# Altium schematic sheet MCU.SchDoc
size A4; SheetNumber: 1; SheetTotal: 2
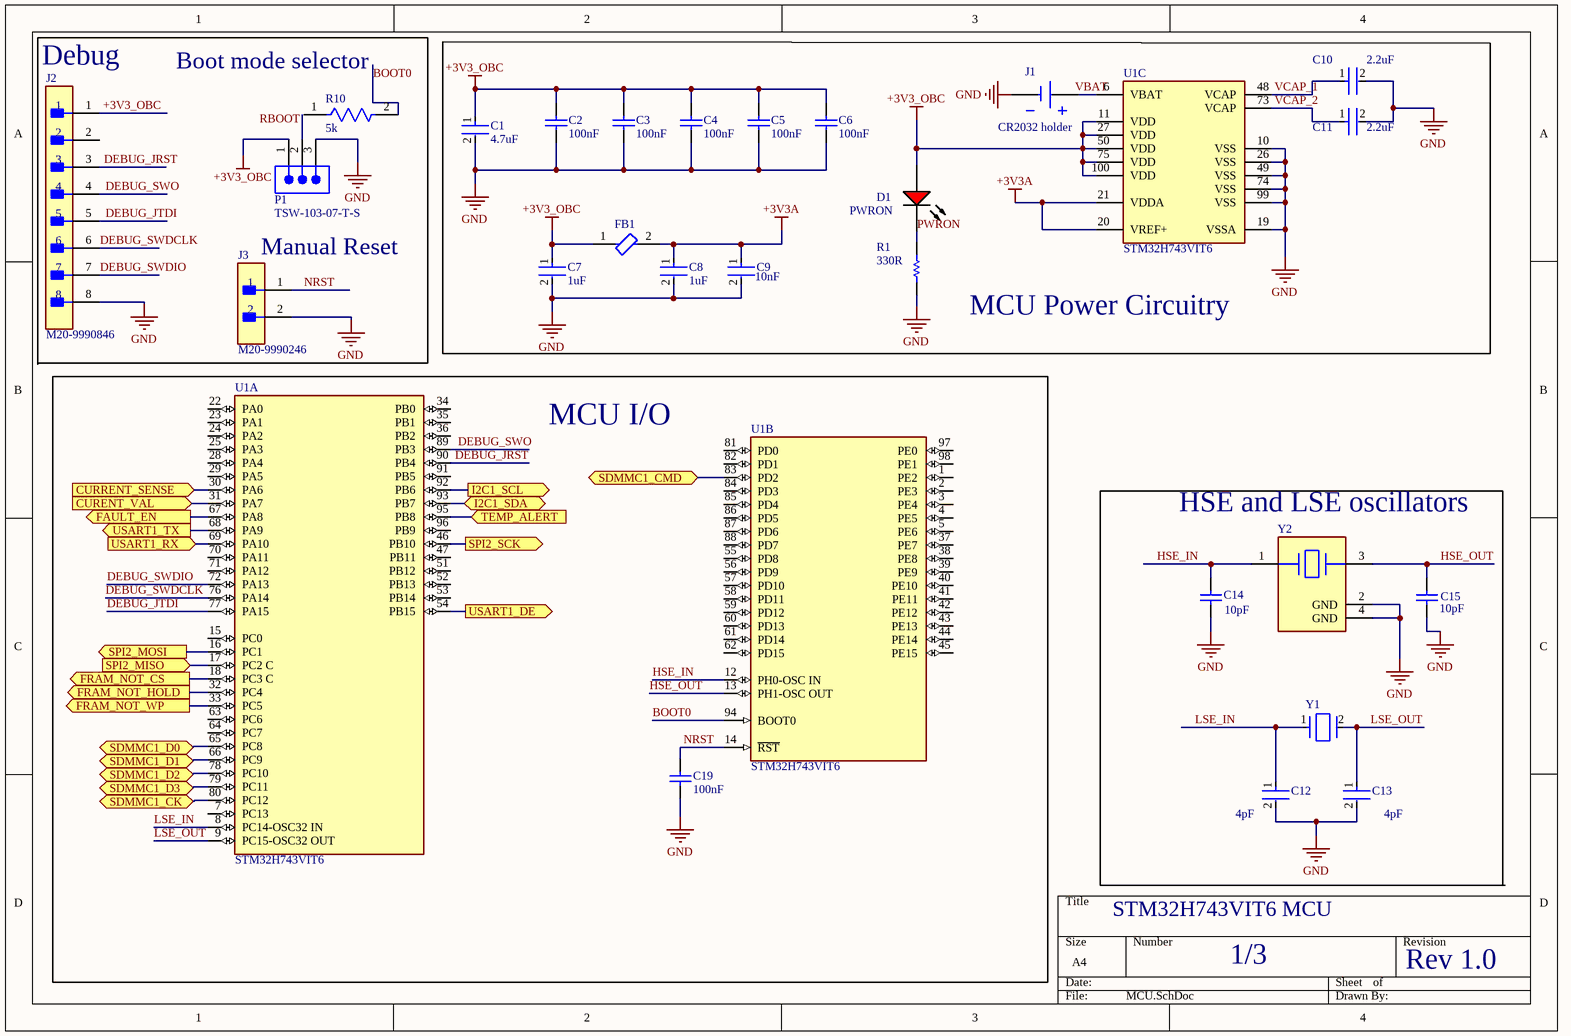
[diagram p0: MCU.SchDoc]

## Parts
C1  4.7uF  [FP-0805-L_2_0_0_1-W_1_25-IPC_B]
C2  100nF  [SAMS-C0603-2_M]
C3  100nF  [SAMS-C0603-2_M]
C4  100nF  [SAMS-C0603-2_M]
C5  100nF  [SAMS-C0603-2_M]
C6  100nF  [SAMS-C0603-2_M]
C7  1uF  [FP-CL10-IPC_C]
C8  1uF  [FP-CL10-IPC_C]
C9  10nF  [FP-CC0402-MFG]
C10  2.2uF  [FP-CC0805-0_85-MFG]
C11  2.2uF  [FP-CC0805-0_85-MFG]
C12  4pF  [FP-GRM033-0_03-IPC_B]
C13  4pF  [FP-GRM033-0_03-IPC_B]
C14  10pF  [CAPC1005X55X25ML05T05]
C15  10pF  [CAPC1005X55X25ML05T05]
C19  100nF  [SAMS-C0603-2_M]
D1  PWRON  [EVRL-0603-2_V]
FB1  MMZ1005D121CTD25  [FP-MMZ1005-IPC_C]  (value not drawn)
J1  CR2032 holder  [KEYSTONE-1025-7-2_V]
J2  M20-9990846  [FP-M20-9990846-MFG]
J3  M20-9990246  [FP-M20-9990246-MFG]
P1  TSW-103-07-T-S  [SMTC-TSW-103-07-X-S]
R1  330R  [RESC1608X55X25NL10T15]
R10  5k  [FP-MCR01-MFG]
U1  STM32H743VIT6  [FP-LQFP100-1L-MFG]  (parts A,B,C of 3)
Y1  ABS06-107-32.768KHZ-T  [FP-ABS06-MFG]  (value not drawn)
Y2  ABM3B-25.000MHZ-10-1-U-T  [FP-ABM3B-MFG]  (value not drawn)

## Blocks framed on the sheet
Debug: J2 J3 P1 R10
MCU Power Circuitry: C1-C11 D1 FB1 J1 R1 U1
MCU I/O: C19 U1
HSE and LSE oscillators: C12-C15 Y1 Y2

## Ports
CURENT_VAL (in), CURRENT_SENSE (in), FAULT_EN (out), FRAM_NOT_CS (out), FRAM_NOT_HOLD (out), FRAM_NOT_WP (out), I2C1_SCL (out), I2C1_SDA (bidir), SDMMC1_CK (bidir), SDMMC1_CMD (bidir), SDMMC1_D0 (bidir), SDMMC1_D1 (bidir), SDMMC1_D2 (bidir), SDMMC1_D3 (bidir), SPI2_MISO (in), SPI2_MOSI (out), SPI2_SCK (out), TEMP_ALERT (in), USART1_DE (out), USART1_RX (in), USART1_TX (out)

## Nets
+3V3_OBC: C1.1 C2.2 C3.2 C4.2 C5.2 C6.2 C7.1 D1.1(A) FB1.1 J2.1 P1.1 U1.11(VDD) U1.27(VDD) U1.50(VDD) U1.75(VDD) U1.100(VDD)
+3V3A: C8.1 C9.1 FB1.2 U1.20(VREF+) U1.21(VDDA)
GND: C1.2 C2.1 C3.1 C4.1 C5.1 C6.1 C7.2 C8.2 C9.2 C10.2 C11.2 C12.2 C13.2 C14.1 C15.1 C19.1 J1.2(-) J2.8 J3.2 P1.3 R1.1 U1.10(VSS) U1.19(VSSA) U1.26(VSS) U1.49(VSS) U1.74(VSS) U1.99(VSS) Y2.2(GND) Y2.4(GND)
BOOT0: R10.2 U1.94(BOOT0)
CURENT_VAL: U1.31(PA7) ; port CURENT_VAL
CURRENT_SENSE: U1.30(PA6) ; port CURRENT_SENSE
DEBUG_JRST: J2.3 U1.90(PB4)
DEBUG_JTDI: J2.5 U1.77(PA15)
DEBUG_SWDCLK: J2.6 U1.76(PA14)
DEBUG_SWDIO: J2.7 U1.72(PA13)
DEBUG_SWO: J2.4 U1.89(PB3)
FAULT_EN: U1.67(PA8) ; port FAULT_EN
FRAM_NOT_CS: U1.18(PC3_C) ; port FRAM_NOT_CS
FRAM_NOT_HOLD: U1.32(PC4) ; port FRAM_NOT_HOLD
FRAM_NOT_WP: U1.33(PC5) ; port FRAM_NOT_WP
HSE_IN: C14.2 U1.12(PH0-OSC_IN) Y2.1
HSE_OUT: C15.2 U1.13(PH1-OSC_OUT) Y2.3
I2C1_SCL: U1.92(PB6) ; port I2C1_SCL
I2C1_SDA: U1.93(PB7) ; port I2C1_SDA
LSE_IN: C12.1 U1.8(PC14-OSC32_IN) Y1.1
LSE_OUT: C13.1 U1.9(PC15-OSC32_OUT) Y1.2
NRST: C19.2 J3.1 U1.14(~{RST})
PWRON: D1.2(K) R1.2
SDMMC1_CK: U1.80(PC12) ; port SDMMC1_CK
SDMMC1_CMD: U1.83(PD2) ; port SDMMC1_CMD
SDMMC1_D0: U1.65(PC8) ; port SDMMC1_D0
SDMMC1_D1: U1.66(PC9) ; port SDMMC1_D1
SDMMC1_D2: U1.78(PC10) ; port SDMMC1_D2
SDMMC1_D3: U1.79(PC11) ; port SDMMC1_D3
SPI2_MISO: U1.17(PC2_C) ; port SPI2_MISO
SPI2_MOSI: U1.16(PC1) ; port SPI2_MOSI
SPI2_SCK: U1.46(PB10) ; port SPI2_SCK
TEMP_ALERT: U1.95(PB8) ; port TEMP_ALERT
USART1_DE: U1.54(PB15) ; port USART1_DE
USART1_RX: U1.69(PA10) ; port USART1_RX
USART1_TX: U1.68(PA9) ; port USART1_TX
VCAP_1: C10.1 U1.48(VCAP)
VCAP_2: C11.1 U1.73(VCAP)
NetJ1_1: J1.1(+) U1.6(VBAT)

Not connected (* = marked no-connect by the designer): J2 2; P1 2; R10 1; U1 1(PE2) 2(PE3) 3(PE4) 4(PE5) 5(PE6) 7(PC13) 15(PC0) 22(PA0) 23(PA1) 24(PA2) 25(PA3) 28(PA4) 29(PA5) 34(PB0) 35(PB1) 36(PB2) 37(PE7) 38(PE8) 39(PE9) 40(PE10) 41(PE11) 42(PE12) 43(PE13) 44(PE14) 45(PE15) 47(PB11) 51(PB12) 52(PB13) 53(PB14) 55(PD8) 56(PD9) 57(PD10) 58(PD11) 59(PD12) 60(PD13) 61(PD14) 62(PD15) 63(PC6) 64(PC7) 70(PA11) 71(PA12) 81(PD0) 82(PD1) 84(PD3) 85(PD4) 86(PD5) 87(PD6) 88(PD7) 91(PB5) 96(PB9) 97(PE0) 98(PE1)

## Notes on the sheet
- (near R10) Boot mode selector
- (near J3) Manual Reset
- STM32H743VIT6 MCU
- 1/3
- Rev 1.0
- Labels drawn without touching a wire or pin: RBOOT, VBAT

## Library data of the parts
C1 = CMP-14477-004784-2: Multilayer Ceramic Capacitor 4.7 uF 16V X7R 10% SMD 0805 T/R; Tolerance: 10%; Voltage Rating: 16V; Height: 1.25mm; Width: 0.049inch; Length: 2mm; Series: M; Case Code (Metric): 2012; Case Code (Imperial): 0805; Dielectric: X7R; Packaging: Tape and Reel; Case/Package: 0805; Capacitance: 4.7uF; Halogen Free: Halogen Free; RoHS Compliant: Yes; Package Quantity: 3000; Contact Plating: Tin; Max Operating Temperature: 125°C; Min Operating Temperature: -55°C; Resistor Type: Ceramic; Mount: Surface Mount; Voltage Rating (DC): 16V; Termination: SMD/SMT; Number of Pins: 2; Thickness: 0.053inch; Construction: Flat
C2-C6 C19 = CMP-2000-05332-1: Multi-layer Ceramic Capacitor, -55 to 125 degC, 2-Pin SMD (0603), RoHS, Tape and Reel; Manufacturer: Samsung Electro-Mechanics; Capacitance: 0.1µF; Rated Voltage: 50V; Dielectric: X7R; Tolerance (%): ±10%; Case Size/Dimension: 0603; Datasheet URL: https://datasheet.ciiva.com/29198/456651-da-01-en-vs-kondensator-0605-29198839.pdf; Manufacturer URL: http://www.samsungsem.com/global/index.jsp; Datasheet Version: Nov-10
C7 C8 = CMP-13271-004127-1: Cap Ceramic 1uF 25V X5R ±10% Pad SMD 0603 +85°C T/R; Height: 0.8mm; Capacitance: 1uF; Depth: 0.8mm; Package Quantity: 1; Mount: Surface Mount; Contact Plating: Tin; Voltage Rating: 25V; Dielectric: X5R; Packaging: Tape and Reel; Material: Ceramic; Case Code (Metric): 1608; Length: 1.6mm; Voltage: 25V; Min Operating Temperature: -55°C; Width: 0.031inch; Tolerance: 10%; Case/Package: 0603; Radiation Hardening: No; Case Code (Imperial): 0603; Thickness: 0.035inch; Lead Free: Lead Free; Max Operating Temperature: 85°C; Voltage Rating (DC): 25V
C9 = CMP-03422-000804-1: CAP CER 10000PF 10V X7R 0402; Manufacturer: YAGEO; Manufacturer Part Number: CC0402KRX7R6BB103; Automotive Grade: NA; Material: Ceramic; Tolerance: 0.1; Temperature Coefficient: 30ppm/°C; Temperature Characteristic: X7R; Digikey Description: CAP CER 10000PF 10V X7R 0402; Footprint Url: http://www.yageo.com/exep/pages/download/literatures/UPY-C_GEN_24.pdf; Category: Cap; RoHS: TRUE; Temperature Range Low: -55°C; Lead Free: Yes; ComponentLink2Description: Datasheet; Device Class L2: Capacitors; Temperature Range High: +125°C; Value: 10 nF; Ipc Land Pattern Name: CAPC10050X50; Temperature: -55°C to +125°C; ComponentLink2URL: http://www.yageo.com/documents/recent/UPY-GP_NP0_16V-to-50V_16.pdf; Device Class L3: Ceramic Capacitors; Capacitance: 10 nF; Package: CC0402; Height: 0.55mm; Automotive: No; Octopart: https://octopart.com/cc0402krx7r6bb103-yageo-26721868; Mouser Description: Multilayer Ceramic Capacitors MLCC - SMD/SMT 10nF 10V X7R 10%; Device Class L1: Passive Components; Voltage Rating: 10 V
C10 C11 = CMP-1036-04838-2: CAP CER 2.2UF 25V X7R 0805; Manufacturer Part Number: CC0805KKX7R8BB225; Manufacturer: Yageo; Material: Ceramic; Tolerance: 0.1; Device Class L1: Passive Components; Value: 2.2 uF; Temperature: -30°C to +85°C; Octopart: https://octopart.com/cc0805kkx7r8bb225-yageo-42522865; ComponentLink2Description: Datasheet; Capacitance: 2.2 uF; ComponentLink2URL: http://www.yageo.com/documents/recent/UPY-GPHC_Y5V_6.3V-to-50V_8.pdf; Mouser Description: Multilayer Ceramic Capacitors MLCC - SMD/SMT 2.2uF 25V X7R 10%; RoHS: TRUE; Temperature Range High: +85°C; Lead Free: Yes; Voltage Rating: 25 V; Height: 0.95mm; Category: Cap; Automotive: No; Digikey Description: CAP CER 2.2UF 25V X7R 0805; Temperature Characteristic: X7R; Ipc Land Pattern Name: CAPC200125X85; Device Class L2: Capacitors; Footprint Url: http://www.yageo.com/exep/pages/download/literatures/UPY-C_GEN_24.pdf; Package: CC0805-0.85; Device Class L3: Ceramic Capacitors; Temperature Range Low: -30°C
C12 C13 = CMP-2010-01389-2: Chip Multilayer Ceramic Capacitors for General Purpose, 0201, 4.0pF, C0G, 30ppm/°C, 0.25pF, 25V; Case Code (Imperial): 0201; Thickness: 0.013inch; Voltage Rating (DC): 25V; Termination: SMD/SMT; Dielectric: C0G; Length: 0.024inch; Height: 0.3mm; Width: 0.012inch; Min Operating Temperature: -55°C; Capacitance: 4pF; Case/Package: 0201; Voltage Rating: 25V; Case Code (Metric): 0603; Packaging: Tape and Reel; Max Operating Temperature: 125°C; Mount: Surface Mount; Package Quantity: 15000; Lead Free: Lead Free
C14 C15 = CMP-2100-03589-1: Chip Capacitor, 10 pF, +/- 5%, 50 V, -55 to 125 degC, 0402 (1005 Metric), RoHS, Tape and Reel; Manufacturer: Yageo; Insulation Resistance: 100GR; Voltage Rating (DC): 50V; Dielectric Material: Ceramic; Temperature Coefficient: 30ppm/degC; Dielectric: C0G; Termination: SMD/SMT; Package Reference: 0402; Lead Free: LeadFree; Composition: Ceramic; Tolerance: 5%; Case Code (Metric): 1005; Voltage Rating: 50V; Packaging: TapeandReel; Manufacturer URL: http://www.yageo.com/; REACH SVHC: NoSVHC; Max Operating Temperature: 125degC; Length: 1mm; Mount: SurfaceMount; Depth: 0.5mm; Min Operating Temperature: -55degC; Number of Pins: 2; Width: 0.02inch; Datasheet Version: Rev. 14, 07/2016; Package Quantity: 1; Datasheet URL: http://www.yageo.com/documents/recent/UPY-GP_NP0_16V-to-50V_14.pdf; Case Code (Imperial): 0402; RoHSCompliant: True; Radiation Hardening: No; Height: 0.5mm; Case/Package: 0402; Thickness: 0.022inch; Capacitance: 10pF; Package Description: 2-Pin Surface Mount Device, Body 1 x 0.5 mm; Voltage: 50V
D1 = CMP-2100-03578-1: Chip LED, Red, 5 V, 25 mA, -40 to 85 degC, 2-Pin SMD (0603), RoHS, Tape and Reel; Manufacturer: Everlight Electronics; Forward Voltage: 2.2V; Lens Style: Clear; Package Reference: 0603; Case/Package: 0603; RoHSCompliant: false; Package Description: 2-Pin Surface Mount Device, Body 1.6 x 0.8 mm; Colour: Red; Lead Free: LeadFree; Datasheet URL: https://datasheet.ciiva.com/4688/el-19-217-r6c-al1m2vy-3tpdf-187026-4688713.pdf; Manufacturer URL: http://www.everlight.com/; Datasheet Version: Rev. 1, 01/2005
FB1 = CMP-08257-000320-1: Signal Line Ferrite Bead 120Ω @ 100MHz 350mA DCR 600mΩ AEC-Q200 SMD 0402; DC Resistance-Max: 600mR; Impedance: 120R; Number of Lines: 1; Max Current Rating: 350mA; Mount: Surface Mount; Case Code (Imperial): 0402; Case Code (Metric): 1005; Lead Free: Lead Free; Series: MMZ; Min Operating Temperature: -55°C; DC Resistance (DCR): 600mR; Height: 0.022inch; Case/Package: 0402; Current Rating: 350mA; Ratings: AEC-Q200; Packaging: Tape and Reel; Max Operating Temperature: 125°C; RoHS Compliant: Yes; Length: 0.039inch; Width: 0.02inch; Package Quantity: 10000
J1 = CMP-0465-00001-2: Holder for 2477 or 2430 Cells P/N 1025-7, Body 27.762 x 30.963 mm, THM; Manufacturer: Keystone; # of Cells: 1; Cell Size: 24 mm; ComponentLink1Description: Manufacturer URL; PackageDescription: 2-Pin Hand Drawn, Body 27.762 x 30.963 mm; Material: Plastic; ComponentLink1URL: http://www.keyelco.com/; Type: HOLDER; ComponentLink2URL: http://www.keyelco.com/product-pdf.cfm?p=3950; Switch Current Limit (Typ) (A): 1; PartNumber: 1025-7; ComponentLink2Description: Datasheet; PackageReference: KEYSTONE-1025-7-2; DatasheetVersion: Rev.C; Mounting Technology: Through Hole
J2 = CMP-15831-000033-1: CONN HEADER VERT 8POS 2.54MM; Connector Type: Male Pin; Gender: Male; Insulation Resistance: 1GR; Number of Positions: 8; Contact Resistance: 30mR; Current Rating: 3A; Termination: Solder; Case/Package: SIL; RoHS Compliant: Yes; Series: M20; Housing Material: Nylon; Radiation Hardening: No; Package Quantity: 1000; Contact Material: Brass; Contact Plating: Tin; Max Operating Temperature: 105°C; Contact Mating Length: 0.24inch; Depth: 2.54mm; Color: Black; Number of Contacts: 8; Mount: Through Hole; Number of Rows: 1; Packaging: Bulk; Min Operating Temperature: -40°C; Max Current Rating: 3A; REACH SVHC: No SVHC; Pitch: 2.54mm; Housing Color: Black; Orientation: Straight; Length: 20.32mm; Contact Type: Male Pin
J3 = CMP-15831-000009-1: CONN HEADER VERT 2POS 2.54MM; Manufacturer: Harwin; Conn Gender: Male; Conn Orientation: Vertical; Number Of Contacts: 2; Current Rating: 3A; ComponentLink2URL: https://cdn.harwin.com/pdfs/M20-999.pdf; ComponentLink2Description: Datasheet; Package: M20-9990246; Temperature: -40°C to +105°C; Octopart: https://octopart.com/m20-9990246-harwin-2590635; Mouser Description: 2.54mm (0.1") Pitch SIL Vertical PC Tail Pin Header, 6.1mm mating pin height, tin, 2 contacts; Temperature Range High: +105°C; Device Class L1: Connectors; RoHS: TRUE; Automotive: No; Height: 8.99mm; Number Of Rows: 1; Contact Material: Tin,Nickel; Category: Conn; Pitch: 2.54mm; Lead Free: Yes; Digikey Description: CONN HEADER VERT 2POS 2.54MM; Manufacturer Part Number: M20-9990246; Temperature Range Low: -40°C; Device Class L3: unset; Device Class L2: Headers and Wire Housings
P1 = CMP-1024-00332-1: 0.025" SQ Post Header, Through-hole, Vertical, -55 to 105 degC, 2.54 mm Pitch, 3-Pin, Male, RoHS; Manufacturer: Samtec; Pitch: 2.54 mm; ComponentLink1URL: http://www.samtec.com; ComponentLink3URL: http://www.samtec.com/documents/webfiles/cpdf/TSW-XXX-XX-XXX-X-XX-XXX-MKT.pdf; PartNumber: TSW-103-07-T-S; Mounting Technology: Through-hole; RoHS: True; DatasheetVersion: F-214; PackageVersion: DM, 8/1988; Temperature Range: -55 to 105 degC; ComponentLink2Description: Datasheet; ComponentLink1Description: Manufacturer URL; Orientation: Vertical; PackageReference: TSW-103-07-X-S; ComponentLink3Description: Package Specification; ComponentLink2URL: http://www.samtec.com/documents/webfiles/pdf/TSW_TH.PDF; PackageDescription: .025[0.64] SQ. Post Terminal Strip Assembly
R1 = CMP-1659-00020-2: Chip Resistor, 330 Ohm, +/- 1%, 0.1 W, -55 to 155 degC, 0603 (1608 Metric), RoHS, Tape and Reel; Tolerance: 10%; ESR: 800 mohm; Voltage Rating (DC): 16 V; Capacitance: 47 uF; Length: 7.3 mm; ComponentLink1URL: http://www.yageo.com/; Packaging: Tape and Reel; Pins: 2; ComponentLink1Description: Manufacturer URL; Case Code (Imperial): 2917; REACH SVHC: No SVHC; Width: 4.3 mm; ComponentLink2Description: Datasheet; Voltage Rating: 16 V; RoHSCompliant: True; Max Operating Temperature: 125degC; ComponentLink2URL: http://www.yageo.com/documents/recent/PYu-RC_Group_51_RoHS_L_04.pdf; Min Operating Temperature: -55degC; Case/Package: 2917; Radiation Hardening: No; DatasheetVersion: Rev. 4, 02/2016; Mount: Surface Mount; PackageReference: 0603; Package Quantity: 500; Case Code (Metric): 7343; PackageDescription: 2-Pin Surface Mount Device, Body 1.6 x 0.8 mm; Height: 3.1 mm
R10 = CMP-08839-006175-1: Thick Film Chip Resistor, 0402, 5.1kΩ, 1%, 100ppm/°C, 0.063W, 50V; Max Power Dissipation: 63mW; Resistance: 5.1kR; Temperature Coefficient: 400ppm/°C; Package Quantity: 10000; Length: 0.039inch; Number of Terminations: 2; Depth: 0.5mm; Case Code (Metric): 1005; Resistor Type: Thick Film; Series: MCR01; Width: 0.02inch; Construction: Rectangular; Case Code (Imperial): 0402; Case/Package: 0402; Voltage Rating (DC): 50V; Lead Free: Lead Free; RoHS Compliant: Yes; Packaging: Tape and Reel; Military Standard: Not; Height: 0.016inch; Max Operating Temperature: 155°C; Min Operating Temperature: -55°C; Tolerance: 1%; Features: Automotive AEC-Q200
U1 = CMP-12105-000050-1: IC MCU 32BIT 2MB FLASH 100LQFP; Manufacturer: STMicroelectronics; Number Of Ethernet Channels: 1; Number Of Usb Channels: 2; Number Of A/D Converters: 3; Min Supply Voltage: 1.71V; Ram Size: 1060KBytes; Number Of I2C Channels: 4; Frequency: 480MHz; Number Of Adc Channels: 36; Number Of I/Os: 82; Max Supply Voltage: 3.6V; Number Of Spi Channels: 6; Memory Size: 2MBytes; Max Junction Temp: +125°C; Core Architecture: Arm Cortex-M7; Interface: I2C,SPI,UART,USART,USB,LIN,IrDA,Ethernet,I2S,Other; Number Of Timers/Counters: 20; Data Bus Width: 32bits; Number Of Pwm Channels: 42; Number Of Uart Channels: 9; Standoff Height: 0.05mm; Device Class L1: Integrated Circuits (ICs); ComponentLink2URL: https://www.st.com/resource/en/datasheet/stm32h743vi.pdf; Automotive: No; Memory Type: FLASH; Number Of Cores: 1; Temperature Range Low: -40°C; RoHS: TRUE; Ambient Temperature Range Low: -40°C; ComponentLink2Description: Datasheet; Device Class L2: Embedded Processors and Controllers; Device Class L3: Microcontrollers; Digikey Description: IC MCU 32BIT 2MB FLASH 100LQFP; Temperature Range High: +125°C; Ambient Temperature Range High: +85°C; Package: LQFP100-1L; Temperature: -40°C to +125°C; Category: IC; Ipc Land Pattern Name: QFP50P1600X1600X160-100; Height: 1.6mm; Manufacturer Part Number: STM32H743VIT6; Octopart: https://octopart.com/stm32h743vit6-stmicroelectronics-76372527; Lead Free: Yes
Y1 = CMP-2000-05734-2: CRYSTAL 32.7680KHZ 4PF SMD; Frequency Tolerance: 20ppm; Series Resistance: 80kR; ESR (Equivalent Series Resistance): 60kR; Frequency Stability: 175ppm; Height: 0.024inch; Termination: SMD/SMT; Package Quantity: 3000; Frequency: 32.768kHz; RoHS Compliant: Yes; Max Operating Temperature: 85°C; Length: 0.079inch; Radiation Hardening: No; Case/Package: 0805; Tolerance: 20ppm; REACH SVHC: No SVHC; Case Code (Imperial): 0805; Width: 0.047inch; Min Operating Temperature: -40°C; Case Code (Metric): 2012; Load Capacitance: 4pF; Mount: Surface Mount; Packaging: Tape and Reel; Lead Free: Lead Free; Number of Pins: 2
Y2 = CMP-27762-002145-1: Crystal 25MHz ±10ppm 10pF SMD-4 5mm x 3.2mm; ESR (Equivalent Series Resistance): 50R; Package Quantity: 1000; Min Operating Temperature: -10°C; Resistor Type: Ceramic; Series: ABM3B; Packaging: Tape and Reel; Case/Package: CSMD; Length: 5mm; Mount: Surface Mount; Tolerance: 10ppm; Height: 0.043inch; Width: 3.2mm; Load Capacitance: 10pF; Frequency: 25MHz; Lead Free: Lead Free; Radiation Hardening: No; Max Operating Temperature: 60°C; Termination: SMD/SMT; Frequency Stability: 10ppm; Number of Pins: 4; RoHS Compliant: Yes; Operating Frequency: 25 MHz; Frequency Tolerance: 10ppm; Depth: 3.2mm; REACH SVHC: No SVHC